# EAGLE design Sensor4 (EAGLE 9.3.0)
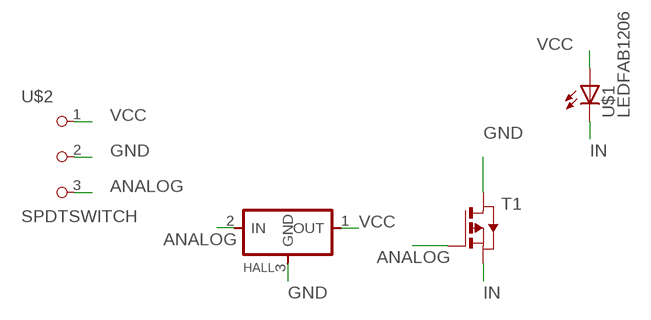
[diagram p0: schematic, sheet 1]

## Parts
HALL  REGULATORSOT23  [SOT23]
T1  PMOSFETSOT23  [SOT-23]
U$1  LEDFAB1206  [LED1206FAB]
U$2  SPDTSWITCH  [SPDTSWITCH]

## Nets
ANALOG: HALL.2(IN) T1.3(G) U$2.3
GND: HALL.3(GND) T1.1(D) U$2.2
IN: T1.2(S) U$1.2(C)
VCC: HALL.1(OUT) U$1.1(A) U$2.1

## Library data of the parts
HALL = fab:REGULATOR
T1 = fab:PMOSFET: MOS FET
U$1 = fab:LED: LED
U$2 = fab:SPDTSWITCH

## Board
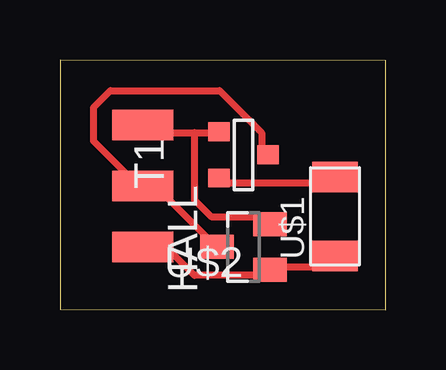
[diagram p1: board, top side]

Size 13.56 x 10.4 mm. Coordinates in mm from the lower left corner, seen from the top.
Outline: 0,0.03 13.56,0 13.56,10.38 0,10.4 0,0.03
Copper layers (1*16): Top 0.035mm / dielectric 1.5mm / Bottom 0.035mm
Design rules "default *": minimum track width 0.3mm, minimum drill 0.35mm, track to track 0.4mm, track to pad 0.4mm, pad to pad 0.4mm, via to via 0.4mm, smd to smd 0.4mm, copper to edge 40mil, drill to drill 6mil, minimum pad ring 10mil, minimum via ring 8mil, stop-mask expansion 4mil, vias tented up to drill 0mil, thermal gap 10mil

### Footprints (pad centres in the part's own frame; a part is rotated, then mirrored left to right if it is on the bottom)
SOT23 = smd 1 x 1.4: 1 -0.95,-1.1; 2 0.95,-1.1; 3 0,1.1
SOT-23 = smd 0.787 x 0.889: 1 0.025,-1.016; 2 -0.94,1.016; 3 0.991,1.016
LED1206FAB = smd 1.27 x 1.905: 1 -1.651,0; 2 1.651,0
SPDTSWITCH = smd 2.54 x 1.27: 1 0.38,2.54; 2 0.38,0; 3 0.38,-2.54

### Placement (x,y rotation side)
HALL  7.65,2.62 90 top
T1  7.65,6.43 90 top
U$1  11.46,3.89 90 top
U$2  3.84,5.16 180 top

### Tracks (layer width: path | path; a pad name or v marks a point on that pad's centre or on a via)
ANALOG
  Top 0.3: 5.6,7.38 3.5,7.38 U$2.3 | 5.6,7.38 6.3,7.38 T1.3 | 5.6,7.38 5.6,4.58 6.3,3.88 8.4,3.88 HALL.2
GND
  Top 0.3: T1.1 8.4,6.68 8.4,7.38 6.65,9.13 2.1,9.13 1.4,8.43 1.4,7.03 3.15,5.28 U$2.2 3.5,4.93 4.2,4.93 6.3,2.83 HALL.3
IN
  Top 0.3: T1.2 6.65,5.28 11.2,5.28 U$1.2
VCC
  Top 0.3: U$1.1 11.2,2.13 10.85,1.78 8.75,1.78 HALL.1 8.4,1.43 5.6,1.43 4.55,2.48 3.5,2.48 U$2.1